# EAGLE schematic axoloti_knobs (EAGLE 7.4.0)
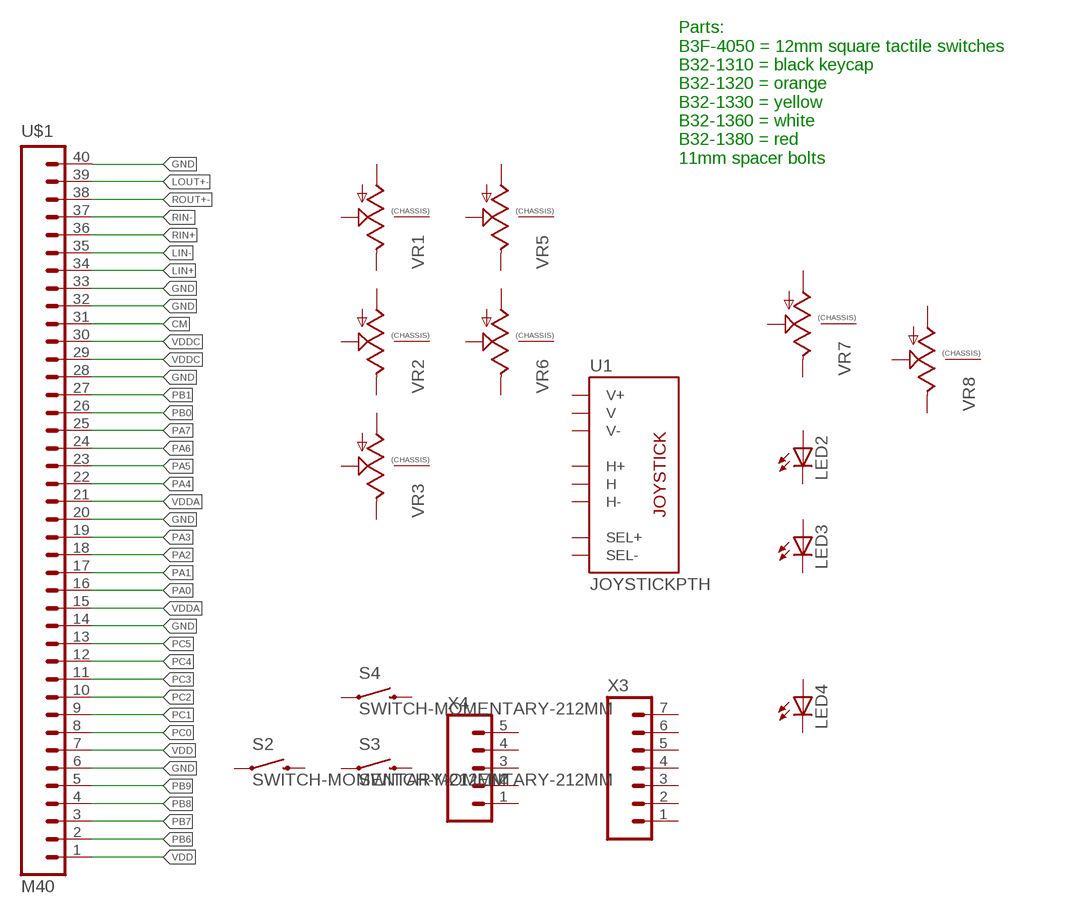
[diagram p0: schematic, sheet 1]

## Parts
LED2  LED3MM  [LED3MM]
LED3  LED3MM  [LED3MM]
LED4  LED3MM  [LED3MM]
S2  SWITCH-MOMENTARY-212MM  [TACTILE-PTH-12MM]
S3  SWITCH-MOMENTARY-212MM  [TACTILE-PTH-12MM]
S4  SWITCH-MOMENTARY-212MM  [TACTILE-PTH-12MM]
U1  JOYSTICKPTH  [JOYSTICK]
U$1  M40  [1X40]
VR1  9MM_SNAP-IN_POT_CHASSIS  [9MM_SNAP-IN_POT]
VR2  9MM_SNAP-IN_POT_CHASSIS  [9MM_SNAP-IN_POT]
VR3  9MM_SNAP-IN_POT_CHASSIS  [9MM_SNAP-IN_POT]
VR5  9MM_SNAP-IN_POT_CHASSIS  [9MM_SNAP-IN_POT]
VR6  9MM_SNAP-IN_POT_CHASSIS  [9MM_SNAP-IN_POT]
VR7  9MM_SNAP-IN_POT_CHASSIS  [9MM_SNAP-IN_POT]
VR8  9MM_SNAP-IN_POT_CHASSIS  [9MM_SNAP-IN_POT]
X3  M07LOCK  [1X07_LOCK]
X4  M05LOCK  [1X05_LOCK]

## Nets
CM: U$1.31
GND: U$1.6 U$1.14 U$1.20 U$1.28 U$1.32 U$1.33 U$1.40
LIN+: U$1.34
LIN-: U$1.35
LOUT+-: U$1.39
PA0: U$1.16
PA1: U$1.17
PA2: U$1.18
PA3: U$1.19
PA4: U$1.22
PA5: U$1.23
PA6: U$1.24
PA7: U$1.25
PB0: U$1.26
PB1: U$1.27
PB6: U$1.2
PB7: U$1.3
PB8: U$1.4
PB9: U$1.5
PC0: U$1.8
PC1: U$1.9
PC2: U$1.10
PC3: U$1.11
PC4: U$1.12
PC5: U$1.13
RIN+: U$1.36
RIN-: U$1.37
ROUT+-: U$1.38
VDD: U$1.1 U$1.7
VDDA: U$1.15 U$1.21
VDDC: U$1.29 U$1.30
Unconnected: LED2.A LED2.K(C) LED3.A LED3.K(C) LED4.A LED4.K(C) S2.1 S2.3 S3.1 S3.3 S4.1 S4.3 U1.B1A(SEL+) U1.B2A(SEL-) U1.H1(H+) U1.H2(H) U1.H3(H-) U1.V1(V+) U1.V2(V) U1.V3(V-) VR1.1(A) VR1.2(S) VR1.3(E) VR1.CHASSIS2 VR2.1(A) VR2.2(S) VR2.3(E) VR2.CHASSIS2 VR3.1(A) VR3.2(S) VR3.3(E) VR3.CHASSIS2 VR5.1(A) VR5.2(S) VR5.3(E) VR5.CHASSIS2 VR6.1(A) VR6.2(S) VR6.3(E) VR6.CHASSIS2 VR7.1(A) VR7.2(S) VR7.3(E) VR7.CHASSIS2 VR8.1(A) VR8.2(S) VR8.3(E) VR8.CHASSIS2 X3.1 X3.2 X3.3 X3.4 X3.5 X3.6 X3.7 X4.1 X4.2 X4.3 X4.4 X4.5

## Notes on the sheet
- Parts: 
  B3F-4050 = 12mm square tactile switches 
  B32-1310 = black keycap 
  B32-1320 = orange 
  B32-1330 = yellow 
  B32-1360 = white
  B32-1380 = red 
  11mm spacer bolts

## Library data of the parts
LED2-LED4 = SparkFun-LED:LED: LEDs Standard schematic elements and footprints for 5mm, 3mm, 1206, and 0603 sized LEDs. 5mm - Spark Fun Electronics SKU : COM-00529 (and others)
S2-S4 = SparkFun-Electromechanical:SWITCH-MOMENTARY-2: Various NO switches- pushbuttons, reed, etc; PROD_ID: SWCH-09185
U1 = SparkFun-Electromechanical:JOYSTICK: Thumb Joystick Joystick commonly found in PS2 controllers. Two pots and a select switch. Footprint proven. Spark Fun Electronics SKU : COM-09032
U$1 = SparkFun-Connectors:M40: 1x40 .1" header
VR1-VR3 VR5-VR8 = MusicThingModular:9MM_SNAP-IN_POT_CHASSIS: 9mm vertical snap-in pot, Alpha / Panasonic style, with a connection to the metal chassis for grounding
X3 = SparkFun-Connectors:M07: Header 7 Standard 7-pin 0.1" header. Use with straight break away headers (SKU : PRT-00116), right angle break away headers (PRT-00553), swiss pins (PRT-00743), machine pins (PRT-00117), and female headers (PRT-00115). NOTES ON THE VARIANTS LOCK and LOCK_LONGPADS... This footprint was designed to help hold the alignment of a through-hole component (i.e. 7-pin header) while soldering it into place. You may notice that each hole has been shifted either up or down by 0.005 of an inch from it's more standard position (which is usually a perfectly straight line). This slight alteration caused the pins (the squares in the middle) to touch the edges of the holes. Because they are alternating, it causes a "brace" to hold the header in place. 0.005 has proven to be the perfect amount of "off-center" position when using our standard breakaway headers. Although looks a little odd when you look at the bare footprint, once you have a header in there, the alteration is very hard to notice. Also, if you push a header all the way into place, it is covered up entirely on the bottom side. This idea of altering the position of holes to aid alignment will be further integrated into the Sparkfun Library for other footprints. It can help hold any component with 3 or more connection pins.
X4 = SparkFun-Connectors:M05: Header 5 Standard 5-pin 0.1" header. Use with straight break away headers (SKU : PRT-00116), right angle break away headers (PRT-00553), swiss pins (PRT-00743), machine pins (PRT-00117), and female headers (PRT-00115). Molex polarized connector foot print use with SKU : PRT-08230 with associated crimp pins and housings.